# EAGLE design RS232-RS485 (EAGLE 5.06)
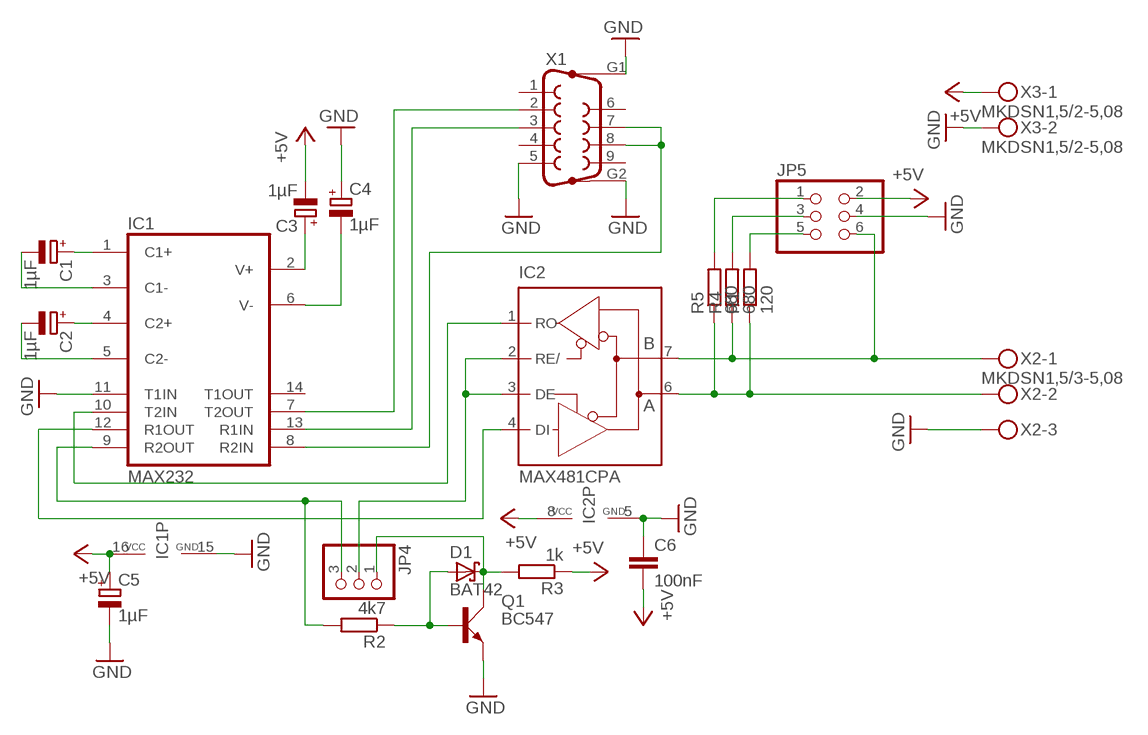
[diagram p0: schematic, sheet 1]

## Parts
C1  1µF  CPOL-EUE2.5-6  [E2,5-6]
C2  1µF  CPOL-EUE2.5-6  [E2,5-6]
C3  1µF  CPOL-EUE2.5-6  [E2,5-6]
C4  1µF  CPOL-EUE2.5-6  [E2,5-6]
C5  1µF  CPOL-EUE2.5-6  [E2,5-6]
C6  100nF  C-EU025-025X050  [C025-025X050]
D1  BAT42  [DO35-10]
IC1  MAX232  [DIL16]
IC2  MAX481CPA  [DIL08]
JP4  PINHD-1X3  [1X03]
JP5  PINHD-2X3  [2X03]
Q1  BC547  [SOT54A]
R1  120  R-EU_0207/10  [0207/10]
R2  4k7  R-EU_0207/10  [0207/10]
R3  1k  R-EU_0207/10  [0207/10]
R4  680  R-EU_0207/10  [0207/10]
R5  680  R-EU_0207/10  [0207/10]
X1  F09HP  [F09HP]
X2  MKDSN1,5/3-5,08  [MKDSN1,5/3-5,08]
X3  MKDSN1,5/2-5,08  [MKDSN1,5/2-5,08]

## Nets
+5V: C3.- C5.+ C6.2 IC1.16(VCC) IC2.8(VCC) JP5.2 R3.1 X3.1
GND: C4.+ C5.- C6.1 IC1.11(T1IN) IC1.15(GND) IC2.5(GND) JP5.4 Q1.E X1.5 X1.G1 X1.G2 X2.3 X3.2
N$1: C1.+ IC1.1(C1+)
N$2: C1.- IC1.3(C1-)
N$3: C2.+ IC1.4(C2+)
N$4: C2.- IC1.5(C2-)
N$5: C3.+ IC1.2(V+)
N$6: C4.- IC1.6(V-)
N$7: IC1.8(R2IN) X1.7 X1.8
N$8: IC2.6(A) R1.1 R5.1 X2.2
N$9: IC2.7(B) JP5.6 R4.1 X2.1
N$10: JP5.1 R5.2
N$11: IC1.7(T2OUT) X1.2
N$12: IC2.2(RE/) IC2.3(DE) JP4.2
N$13: IC1.10(T2IN) IC2.1(RO)
N$14: IC1.12(R1OUT) IC2.4(DI)
N$15: IC1.9(R2OUT) JP4.3 R2.2
N$16: IC1.13(R1IN) X1.3
N$17: D1.A Q1.B R2.1
N$18: D1.C JP4.1 Q1.C R3.2
N$20: JP5.3 R4.2
N$21: JP5.5 R1.2
Unconnected: IC1.14(T1OUT) X1.1 X1.4 X1.6 X1.9

## Library data of the parts
C1-C5 = rcl:CPOL-EU: POLARIZED CAPACITOR, European symbol
C6 = rcl:C-EU: CAPACITOR, European symbol
D1 = diode:BAT42: DIODE barrier diode
IC1 = maxim:MAX232: RS232 TRANSEIVER
IC2 = maxim:MAX481CPA: RS485 TRANSEIVER
JP4 = pinhead:PINHD-1X3: PIN HEADER
JP5 = pinhead:PINHD-2X3: PIN HEADER
Q1 = transistor-small-signal:BC547: NPN TRANSISTOR
R1-R5 = rcl:R-EU_: RESISTOR, European symbol
X1 = con-subd:F09HP: SUB-D
X2 = con-phoenix-508:MKDSN1,5/3-5,08: MKDSN 1,5/ 3-5,08 Printklemme Nennstrom: 13,5 A Nennspannung: 250 V Rastermaß: 5,08 mm Polzahl: 3 Anschlussart: Schraubanschluss Montage: Löten Anschlussrichtung Leiter/Platine: 0 ° Artikelnummer: 1729131 Source: http://eshop.phoenixcontact.com .. 1729131.pdf
X3 = con-phoenix-508:MKDSN1,5/2-5,08: MKDSN 1,5/ 2-5,08 Printklemme Nennstrom: 13,5 A Nennspannung: 250 V Rastermaß: 5,08 mm Polzahl: 2 Anschlussart: Schraubanschluss Montage: Löten Anschlussrichtung Leiter/Platine: 0 ° Artikelnummer: 1729128 Source: http://eshop.phoenixcontact.com .. 1729128.pdf

## Board
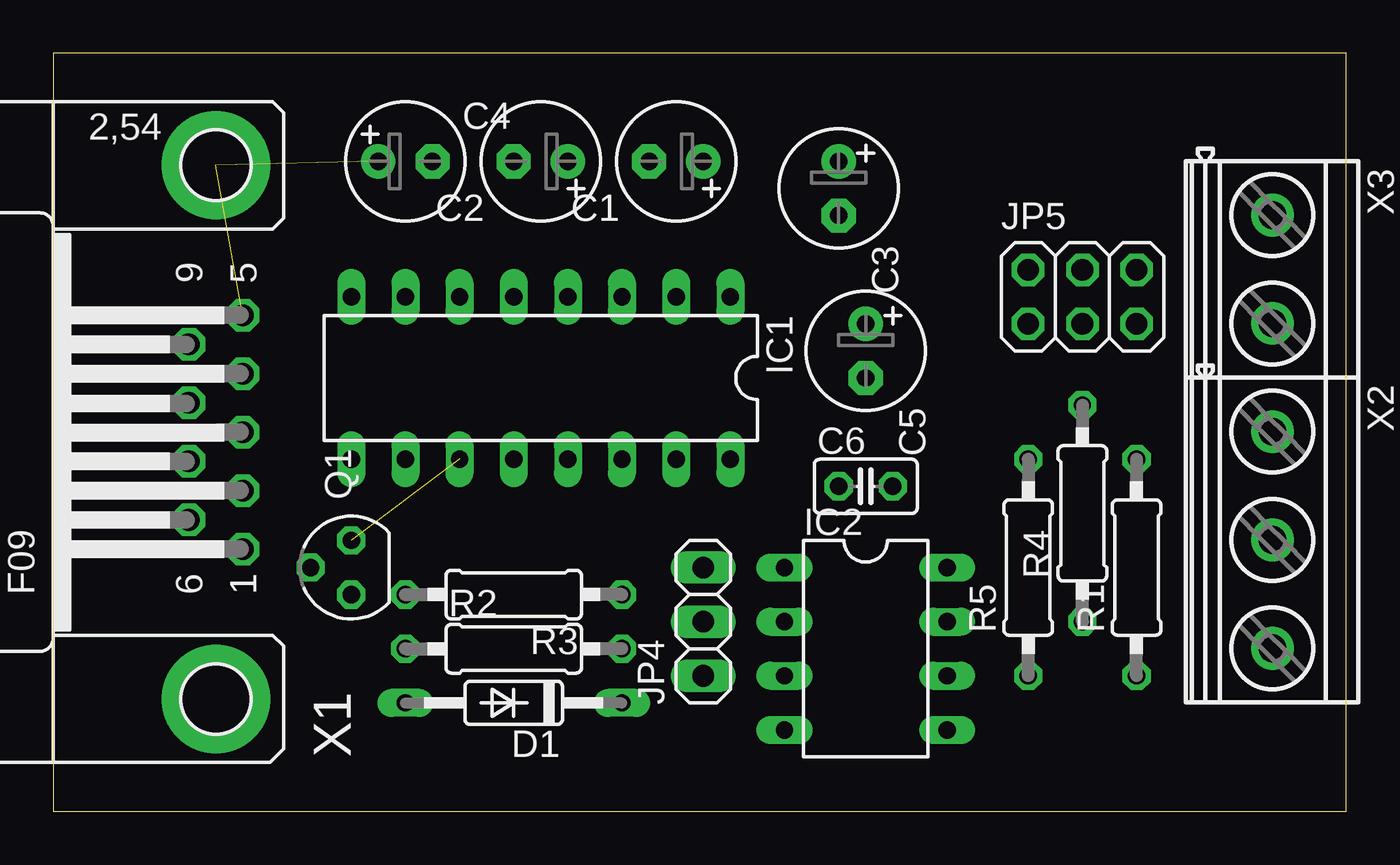
[diagram p1: board, top side]
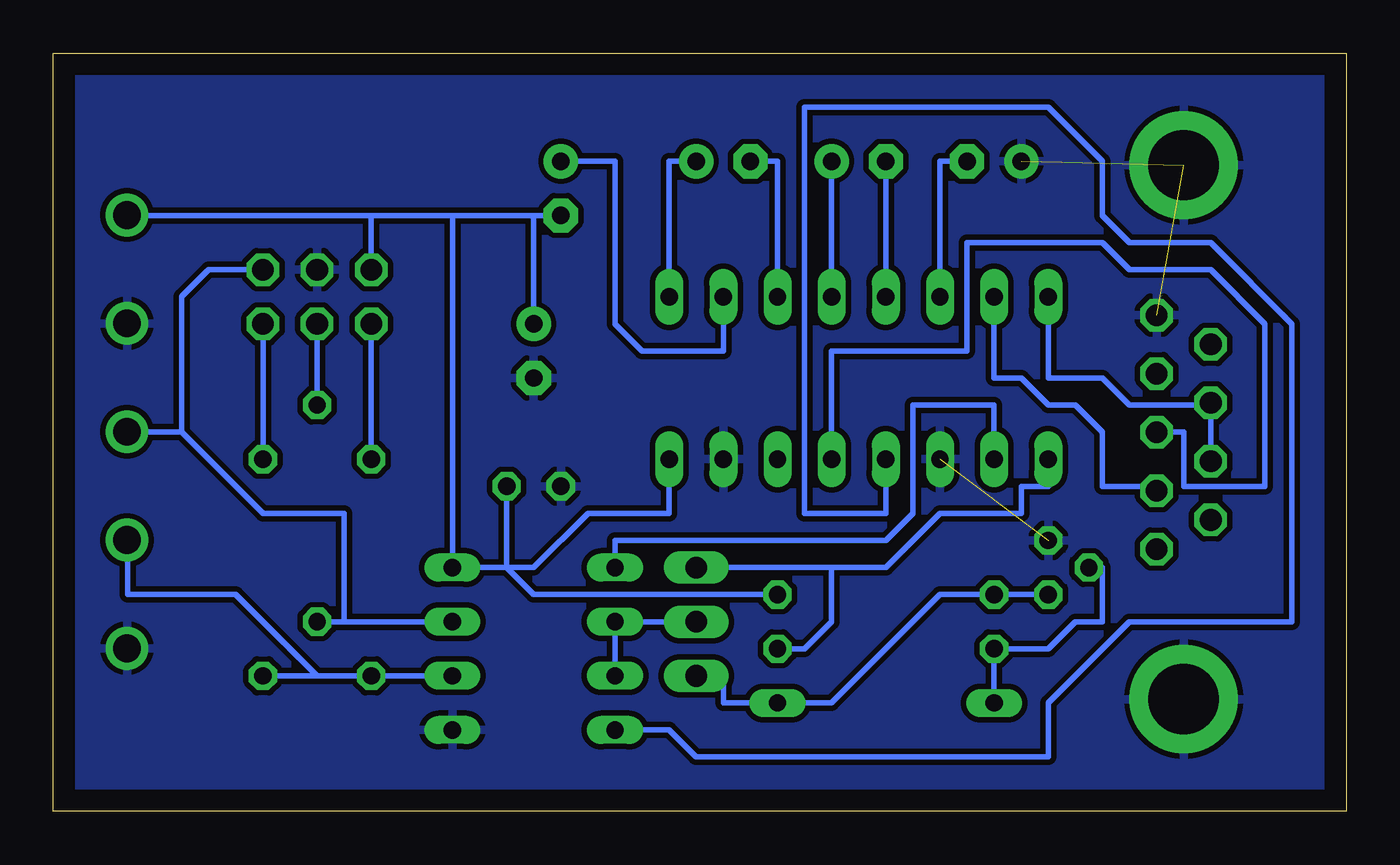
[diagram p2: board, bottom side, seen from below]

Size 60.63 x 35.55 mm. Coordinates in mm from the lower left corner, seen from the top.
Outline: 0,0 60.63,0 60.63,35.55 0,35.55 0,0
Copper layers (1*16): Top 0.035mm / dielectric 1.5mm / Bottom 0.035mm
Design rules "default *": minimum track width 10mil, minimum drill 24mil, track to track 10mil, track to pad 10mil, pad to pad 10mil, via to via 10mil, smd to smd 8mil, copper to edge 40mil, drill to drill 8mil, minimum pad ring 10mil, minimum via ring 8mil, stop-mask expansion 4mil, vias tented up to drill 0mil, thermal gap 10mil

### Footprints (pad centres in the part's own frame; a part is rotated, then mirrored left to right if it is on the bottom)
E2,5-6 = drill 0.813 pad 1.6 round: + -1.27,0 | drill 0.813 pad 1.6 octagon: - 1.27,0
C025-025X050 = drill 0.813 octagon: 1 -1.27,0; 2 1.27,0
DO35-10 = drill 0.813 long: A 5.08,0; C -5.08,0
DIL16 = drill 0.813 long: 1 -8.89,-3.81; 2 -6.35,-3.81; 3 -3.81,-3.81; 4 -1.27,-3.81; 5 1.27,-3.81; 6 3.81,-3.81; 7 6.35,-3.81; 8 8.89,-3.81; 9 8.89,3.81; 10 6.35,3.81; 11 3.81,3.81; 12 1.27,3.81; 13 -1.27,3.81; 14 -3.81,3.81; 15 -6.35,3.81; 16 -8.89,3.81
DIL08 = drill 0.813 long: 1 -3.81,-3.81; 2 -1.27,-3.81; 3 1.27,-3.81; 4 3.81,-3.81; 5 3.81,3.81; 6 1.27,3.81; 7 -1.27,3.81; 8 -3.81,3.81
1X03 = drill 1.016 long: 1 -2.54,0; 2 0,0; 3 2.54,0
2X03 = drill 1.016 octagon: 1 -2.54,-1.27; 2 -2.54,1.27; 3 0,-1.27; 4 0,1.27; 5 2.54,-1.27; 6 2.54,1.27
SOT54A = drill 0.813 octagon: B 0,1.905; C -1.27,0; E 1.27,0
0207/10 = drill 0.813 octagon: 1 -5.08,0; 2 5.08,0
F09HP = drill 1.016 octagon: 1 -5.486,-1.27; 2 -2.743,-1.27; 3 0,-1.27; 4 2.743,-1.27; 5 5.486,-1.27; 6 -4.115,1.27; 7 -1.372,1.27; 8 1.372,1.27; 9 4.115,1.27 | drill 3.302 pad 5.08 round: G1 -12.522,0; G2 12.522,0
MKDSN1,5/3-5,08 = drill 1.3 pad 2 round: 1 -7.641,0.025; 2 -2.561,0.025; 3 2.519,0.025
MKDSN1,5/2-5,08 = drill 1.3 pad 2 round: 1 -2.561,0.025; 2 2.519,0.025

### Placement (x,y rotation side)
C1  29.21,30.48 180 top
C2  22.86,30.48 180 top
C3  36.83,29.21 270 top
C4  16.51,30.48 0 top
C5  38.1,21.59 270 top
C6  38.1,15.24 0 top
D1  21.59,5.08 180 top
IC1  22.86,20.32 180 top
IC2  38.1,7.62 270 top
JP4  30.48,8.89 90 top
JP5  48.26,24.13 0 top
Q1  13.97,11.43 90 top
R1  50.8,11.43 90 top
R2  21.59,7.62 0 top
R3  21.59,10.16 180 top
R4  48.26,13.97 90 top
R5  45.72,11.43 90 top
X1  7.62,17.78 90 top
X2  57.15,10.16 270 top
X3  57.15,25.4 270 top

### Tracks (layer width: path | path; a pad name or v marks a point on that pad's centre or on a via)
+5V
  Bottom 0.254: R3.1 38.1,10.16 39.37,11.43 | 39.37,11.43 IC2.8 41.91,27.94 | IC1.16 31.75,13.97 35.56,13.97 38.1,11.43 39.37,11.43 | 39.37,11.43 C6.2 | 45.72,27.94 JP5.2 | 45.72,27.94 57.15,27.94 X3.1 | 41.91,27.94 45.72,27.94 | 41.91,27.94 38.1,27.94 | 38.1,27.94 C3.- | 38.1,27.94 C5.+
GND  (3 unrouted)
  pour Bottom: 0,35.56 60.96,35.56 60.96,0 0,0
N$1
  Bottom 0.254: IC1.1 31.75,30.48 C1.+
N$2
  Bottom 0.254: IC1.3 26.67,30.48 C1.-
N$3
  Bottom 0.254: IC1.4 C2.+
N$4
  Bottom 0.254: IC1.5 C2.-
N$5
  Bottom 0.254: IC1.2 29.21,21.59 33.02,21.59 34.29,22.86 34.29,30.48 C3.+
N$6
  Bottom 0.254: IC1.6 19.05,30.48 C4.-
N$7
  Bottom 0.254: IC1.8 13.97,20.32 11.43,20.32 10.16,19.05 6.35,19.05 | X1.7 6.35,19.05 | 6.35,19.05 X1.8
N$8
  Bottom 0.254: IC2.6 R5.1 48.26,6.35 | 48.26,6.35 R1.1 | 48.26,6.35 52.07,10.16 57.15,10.16 57.15,12.7 X2.2
N$9
  Bottom 0.254: 46.99,8.89 R4.1 | IC2.7 46.99,8.89 | JP5.6 53.34,25.4 54.61,24.13 54.61,17.78 | 54.61,17.78 57.15,17.78 X2.1 | 46.99,8.89 46.99,13.97 50.8,13.97 54.61,17.78
N$10
  Bottom 0.254: R5.2 JP5.1
N$11
  Bottom 0.254: IC1.7 16.51,20.32 15.24,20.32 13.97,19.05 12.7,19.05 11.43,17.78 11.43,15.24 8.89,15.24 X1.2
N$12
  Bottom 0.254: IC2.3 IC2.2 JP4.2
N$13
  Bottom 0.254: IC1.10 16.51,19.05 20.32,19.05 20.32,13.97 21.59,12.7 34.29,12.7 IC2.1
N$14
  Bottom 0.254: IC1.12 21.59,13.97 25.4,13.97 25.4,33.02 13.97,33.02 11.43,30.48 11.43,27.94 10.16,26.67 6.35,26.67 2.54,22.86 2.54,8.89 10.16,8.89 13.97,5.08 13.97,2.54 30.48,2.54 31.75,3.81 IC2.4
N$15
  Bottom 0.254: R2.2 25.4,7.62 24.13,8.89 24.13,11.43 | 24.13,11.43 JP4.3 | IC1.9 13.97,15.24 15.24,15.24 15.24,13.97 19.05,13.97 21.59,11.43 24.13,11.43
N$16
  Bottom 0.254: IC1.13 24.13,21.59 17.78,21.59 17.78,26.67 11.43,26.67 10.16,25.4 6.35,25.4 3.81,22.86 3.81,15.24 7.62,15.24 7.62,17.78 X1.3
N$17
  Bottom 0.254: D1.A R2.1 13.97,7.62 12.7,8.89 11.43,8.89 11.43,11.43 Q1.B
N$18
  Bottom 0.254: Q1.C R3.2 19.05,10.16 24.13,5.08 D1.C 29.21,5.08 29.21,6.35 JP4.1
N$20
  Bottom 0.254: R4.2 JP5.3
N$21
  Bottom 0.254: R1.2 JP5.5